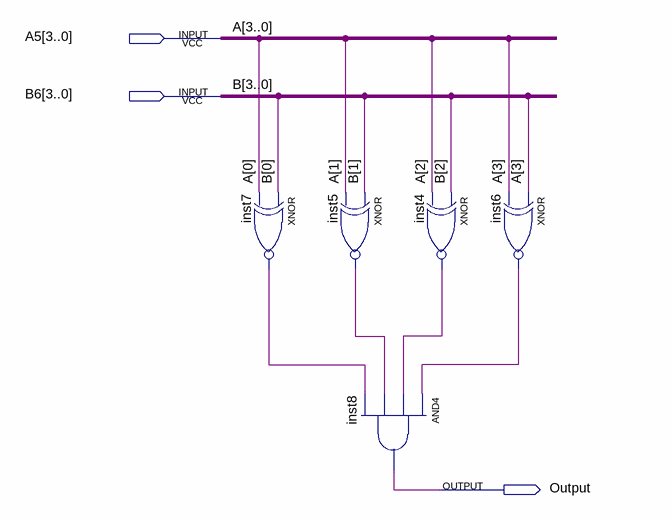
[diagram p0: schematic sheet]
// Quartus schematic Igual.bdf as structural Verilog: 5 symbols, 3 pins
module Igual (
  input  [3:0] A5,
  input  [3:0] B6,
  output Output
);

  wire inst4_out, inst5_out, inst6_out, inst7_out;

  xnor inst7 (inst7_out, B6[0], A5[0]);
  xnor inst5 (inst5_out, B6[1], A5[1]);
  and inst8 (Output, inst6_out, inst4_out, inst5_out, inst7_out);
  xnor inst4 (inst4_out, B6[2], A5[2]);
  xnor inst6 (inst6_out, A5[3], A5[3]);

  // Other names for the same wires on the sheet: A[3:0] = A5; B[3:0] = B6
endmodule
